# EAGLE design IMU-BLIMP (EAGLE 6.6.0)
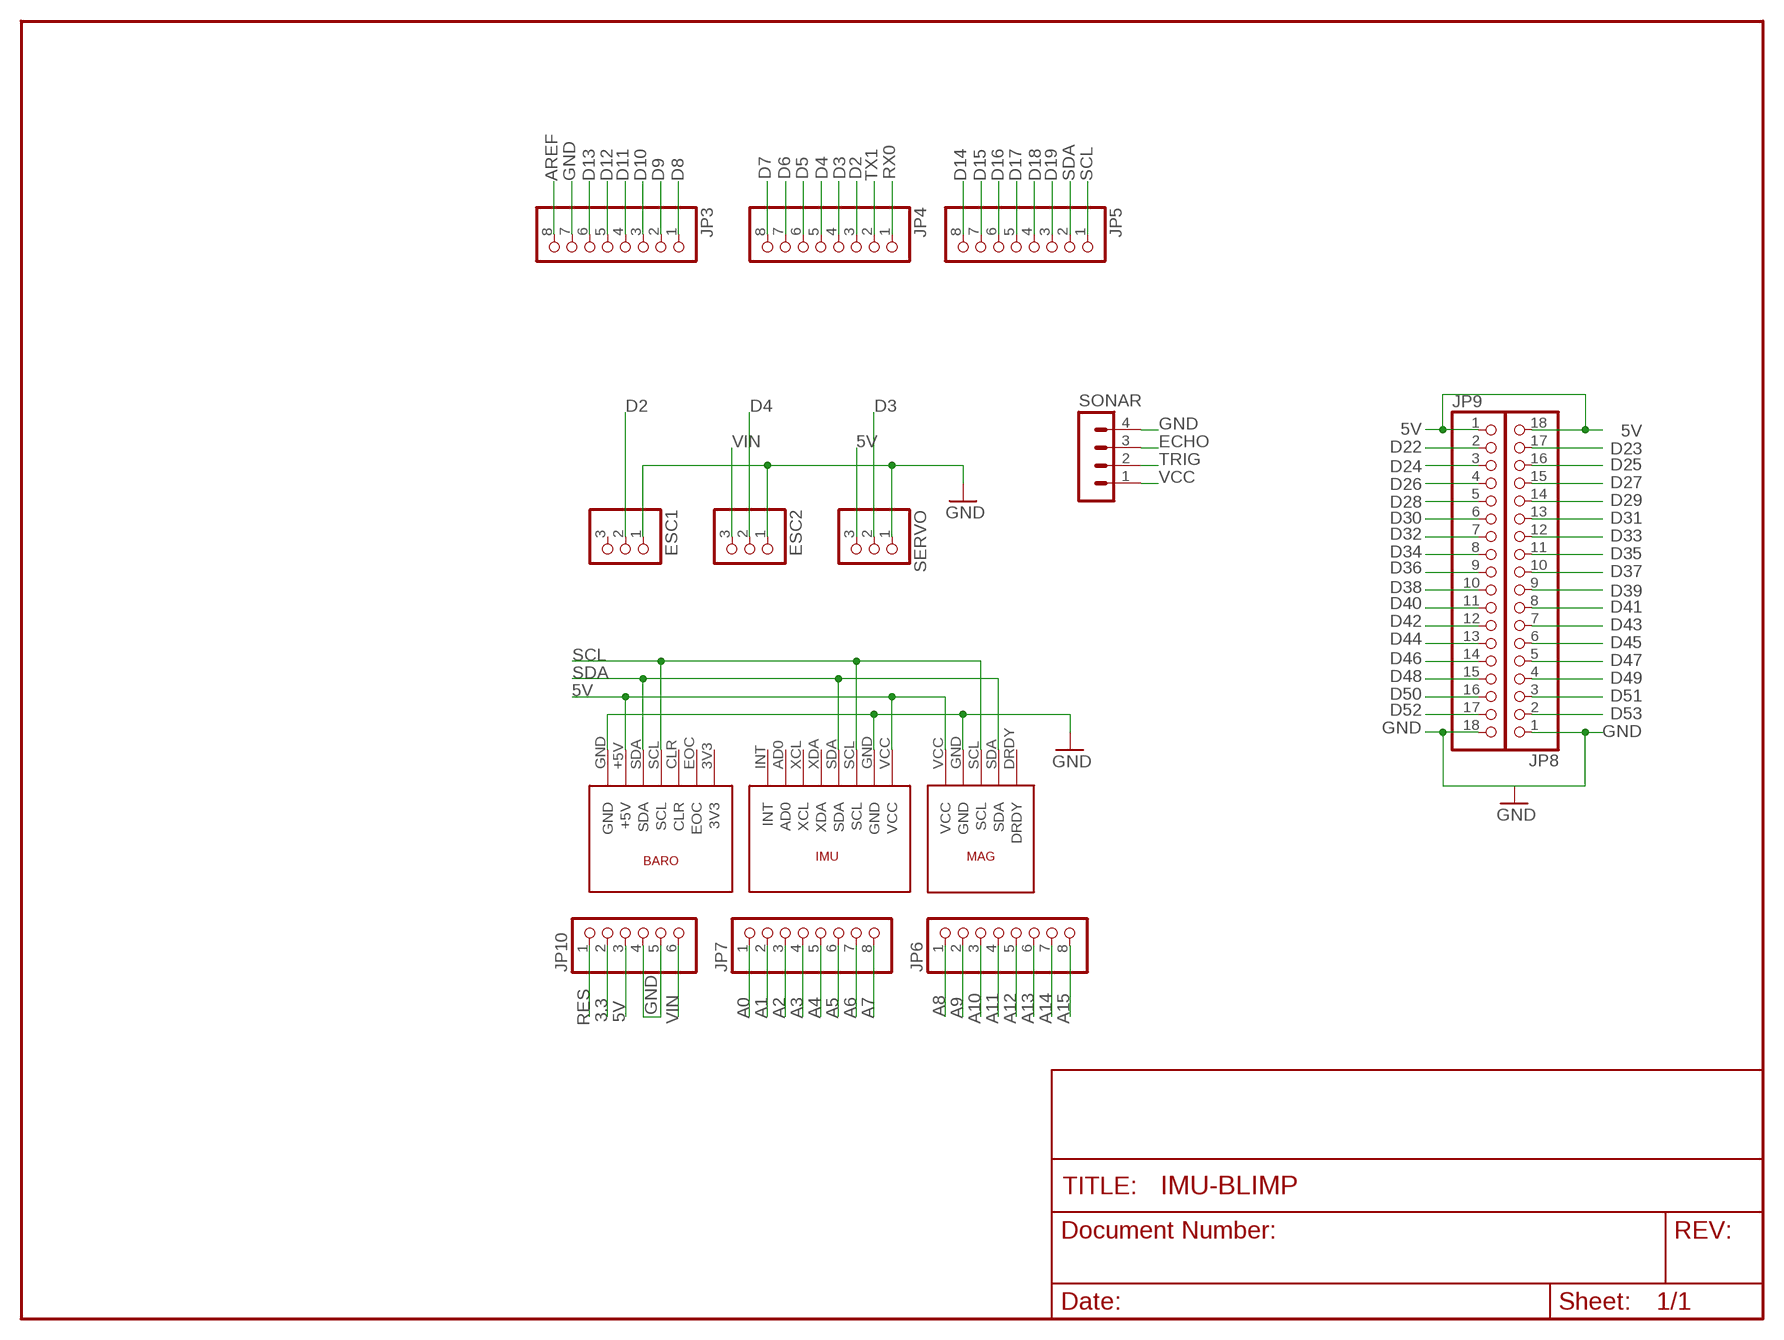
[diagram p0: schematic, sheet 1]

## Parts
BARO1  BMP085  [BMP085]
ESC1  PINHD-1X3CB  [1X03-CLEANBIG]
ESC2  PINHD-1X3CB  [1X03-CLEANBIG]
IMU1  MPU6050  [MPU6050]
JP3  PINHD-1X8CLEANBIG  [1X08-CLEANBIG]
JP4  PINHD-1X8CLEANBIG  [1X08-CLEANBIG]
JP5  PINHD-1X8CLEANBIG  [1X08-CLEANBIG]
JP6  PINHD-1X8CLEANBIG  [1X08-CLEANBIG]
JP7  PINHD-1X8CLEANBIG  [1X08-CLEANBIG]
JP8  PINHD-1X18-BIG  [1X18-BIG]
JP9  PINHD-1X18-BIG  [1X18-BIG]
JP10  PINHD-1X6CB  [1X06-CLEANBIG]
MAG1  HMC5883L  [HMC5883L]
SERVO  PINHD-1X3CB  [1X03-CLEANBIG]
SONAR  MA04-1  [MA04-1]

## Nets
3.3: JP10.2
5V: BARO1.+5V IMU1.VCC JP8.18 JP9.1 JP10.3 MAG1.VCC SERVO.3 SONAR.1
A0: JP7.1
A1: JP7.2
A2: JP7.3
A3: JP7.4
A4: JP7.5
A5: JP7.6
A6: JP7.7
A7: JP7.8
A8: JP6.1
A9: JP6.2
A10: JP6.3
A11: JP6.4
A12: JP6.5
A13: JP6.6
A14: JP6.7
A15: JP6.8
AREF: JP3.8
D2: ESC1.2 JP4.3
D3: JP4.4 SERVO.2
D4: ESC2.2 JP4.5
D5: JP4.6 SONAR.3
D6: JP4.7 SONAR.2
D7: JP4.8
D8: JP3.1
D9: JP3.2
D10: JP3.3
D11: JP3.4
D12: JP3.5
D13: JP3.6
D14: JP5.8
D15: JP5.7
D16: JP5.6
D17: JP5.5
D18: JP5.4
D19: JP5.3
D22: JP9.2
D23: JP8.17
D24: JP9.3
D25: JP8.16
D26: JP9.4
D27: JP8.15
D28: JP9.5
D29: JP8.14
D30: JP9.6
D31: JP8.13
D32: JP9.7
D33: JP8.12
D34: JP9.8
D35: JP8.11
D36: JP9.9
D37: JP8.10
D38: JP9.10
D39: JP8.9
D40: JP9.11
D41: JP8.8
D42: JP9.12
D43: JP8.7
D44: JP9.13
D45: JP8.6
D46: JP9.14
D47: JP8.5
D48: JP9.15
D49: JP8.4
D50: JP9.16
D51: JP8.3
D52: JP9.17
D53: JP8.2
GND: BARO1.GND ESC1.1 ESC2.1 IMU1.GND JP3.7 JP8.1 JP9.18 JP10.4 JP10.5 MAG1.GND SERVO.1 SONAR.4
RES: JP10.1
RX0: JP4.1
SCL: BARO1.SCL IMU1.SCL JP5.1 MAG1.SCL
SDA: BARO1.SDA IMU1.SDA JP5.2 MAG1.SDA
TX1: JP4.2
VIN: ESC2.3 JP10.6
Unconnected: BARO1.3V3 BARO1.CLR BARO1.EOC ESC1.3 IMU1.AD0 IMU1.INT IMU1.XCL IMU1.XDA MAG1.DRDY

## Notes on the sheet
- GND
- D2 | D4 | D3
- 5V | 5V
- GND
- VIN | 5V | ECHO
- TRIG
- VCC
- SCL
- SDA
- 5V
- GND | GND
- GND
- 5V

## Library data of the parts
BARO1 = BLIMP:BMP085: Barometer sensor
ESC1 ESC2 SERVO = adafruit:PINHD-1X3: PIN HEADER
IMU1 = BLIMP:MPU6050: Inertial Measurement Unit
JP3-JP7 = adafruit:PINHD-1X8: PIN HEADER
JP8 JP9 = adafruit:PINHD-1X18: PIN HEADER
JP10 = adafruit:PINHD-1X6: PIN HEADER
MAG1 = BLIMP:HMC5883L: Magnetometer sensor
SONAR = con-lstb:MA04-1: PIN HEADER; OC_FARNELL: unknown; OC_NEWARK: unknown

## Board
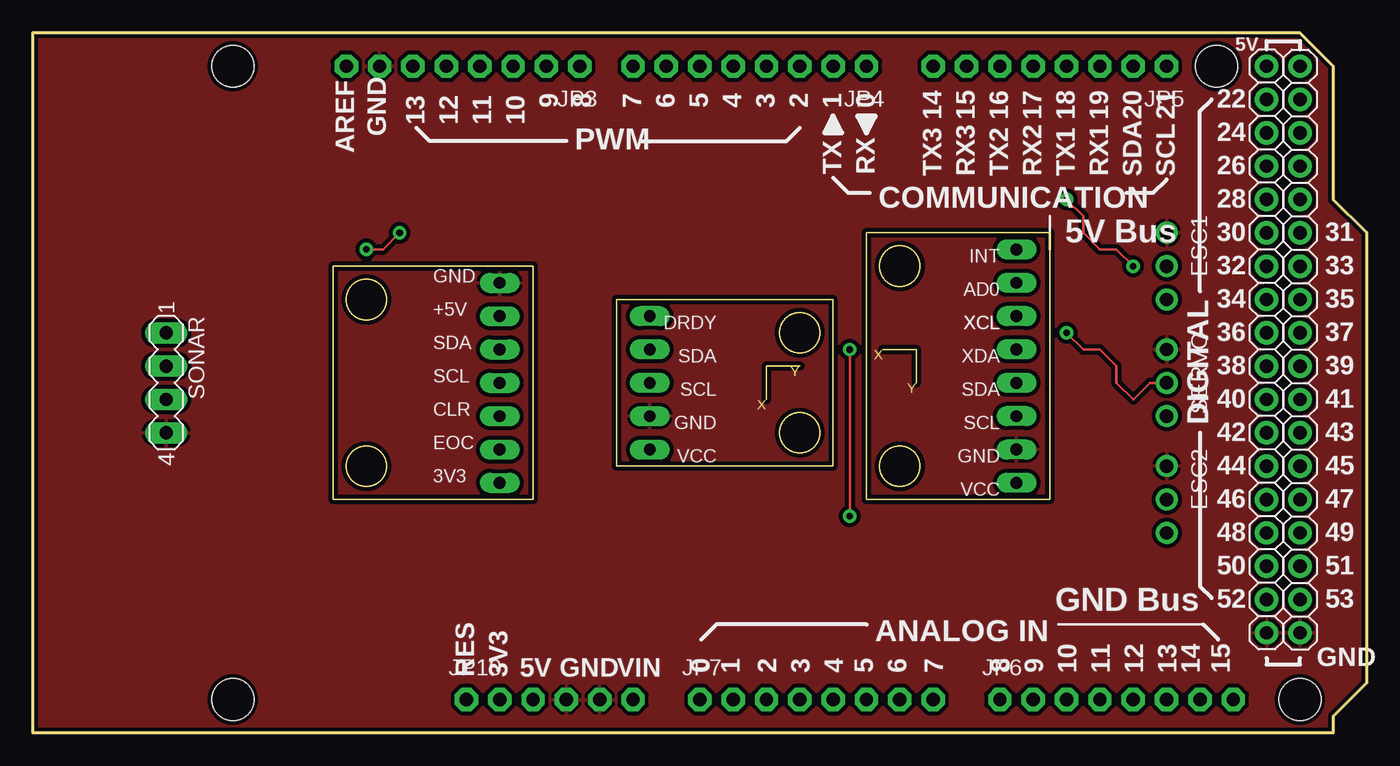
[diagram p1: board, top side]
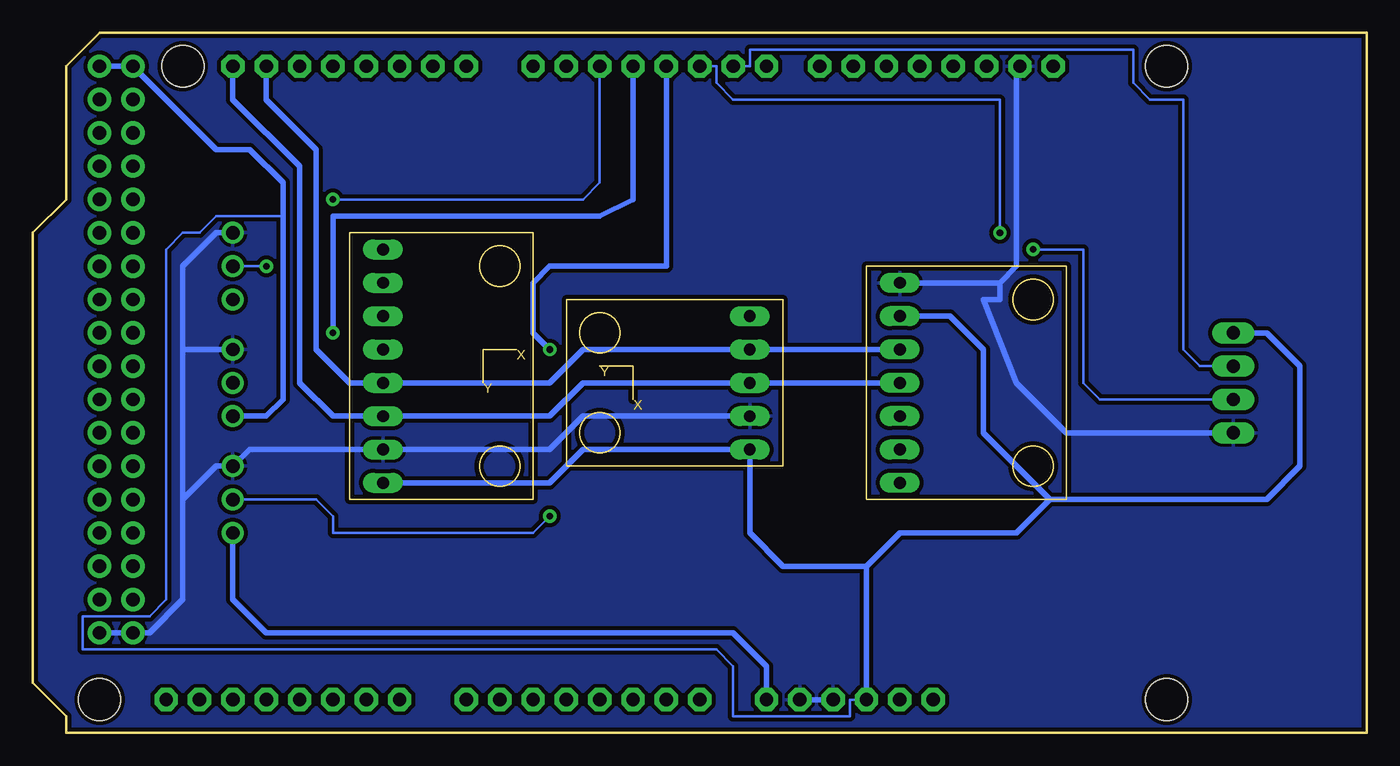
[diagram p2: board, bottom side, seen from below]

Size 101.6 x 53.34 mm. Coordinates in mm from the lower left corner, seen from the top.
Outline: 0,0 99.06,0 99.06,1.27 101.6,3.81 101.6,38.1 99.06,40.64 99.06,50.8 96.52,53.34 0,53.34 0,0
Copper layers (1*16): Top 0.035mm / dielectric 1.5mm / Bottom 0.035mm
Design rules "SparkFun": minimum track width 8mil, minimum drill 20mil, track to track 8mil, track to pad 8mil, pad to pad 8mil, via to via 8mil, smd to smd 8mil, copper to edge 10mil, drill to drill 8mil, minimum pad ring 12mil, minimum via ring 10mil, stop-mask expansion 4mil, vias tented up to drill 25mil, thermal gap 10mil
Holes 3.2 mm at 15.24,50.8 15.24,2.54 90.17,50.8 96.52,2.54

### Footprints (pad centres in the part's own frame; a part is rotated, then mirrored left to right if it is on the bottom)
BMP085 = drill 0.9 pad 1.27 long: 3V3 5.08,-7.62; +5V 5.08,5.08; CLR 5.08,-2.54; EOC 5.08,-5.08; GND 5.08,7.62; SCL 5.08,0; SDA 5.08,2.54
1X03-CLEANBIG = drill 1.016 pad 1.676: 1 -2.54,0; 2 0,0; 3 2.54,0
MPU6050 = drill 0.9 pad 1.27 long: AD0 -3.81,-6.35; GND -3.81,6.35; INT -3.81,-8.89; SCL -3.81,3.81; SDA -3.81,1.27; VCC -3.81,8.89; XCL -3.81,-3.81; XDA -3.81,-1.27
1X08-CLEANBIG = drill 1.016 pad 1.778 octagon: 1 -8.89,0; 2 -6.35,0; 3 -3.81,0; 4 -1.27,0; 5 1.27,0; 6 3.81,0; 7 6.35,0; 8 8.89,0
1X18-BIG = drill 1.016 pad 1.778: 1 -21.59,0; 2 -19.05,0; 3 -16.51,0; 4 -13.97,0; 5 -11.43,0; 6 -8.89,0; 7 -6.35,0; 8 -3.81,0; 9 -1.27,0; 10 1.27,0; 11 3.81,0; 12 6.35,0; 13 8.89,0; 14 11.43,0; 15 13.97,0; 16 16.51,0; 17 19.05,0; 18 21.59,0
1X06-CLEANBIG = drill 1.016 pad 1.778 octagon: 1 -6.35,0; 2 -3.81,0; 3 -1.27,0; 4 1.27,0; 5 3.81,0; 6 6.35,0
HMC5883L = drill 0.9 pad 1.27 long: DRDY 6.35,-5.08; GND 6.35,2.54; SCL 6.35,0; SDA 6.35,-2.54; VCC 6.35,5.08
MA04-1 = drill 1.016 long: 1 -3.81,0; 2 -1.27,0; 3 1.27,0; 4 3.81,0

### Placement (x,y rotation side)
BARO1  30.48,26.67 0 top
ESC1  86.36,35.56 270 top
ESC2  86.36,17.78 270 top
IMU1  71.12,27.94 180 top
JP3  32.77,50.8 180 top
JP4  54.61,50.8 180 top
JP5  77.47,50.8 180 top
JP6  82.55,2.54 0 top
JP7  59.69,2.54 0 top
JP8  96.52,29.21 90 top
JP9  93.98,29.21 270 top
JP10  39.37,2.54 0 top
MAG1  53.34,26.67 180 top
SERVO  86.36,26.67 270 top
SONAR  10.16,26.67 270 top

### Tracks (layer width: path | path; a pad name or v marks a point on that pad's centre or on a via)
5V
  Bottom 0.203: 82.55,39.37 87.63,39.37 88.9,38.1 90.17,38.1 91.44,36.83 91.44,10.16 92.71,8.89 97.79,8.89 97.79,6.35 49.53,6.35 48.26,5.08 48.26,1.27 39.37,1.27 39.37,2.54 JP10.3
  Bottom 0.406: IMU1.VCC 62.23,19.05 59.69,21.59 MAG1.VCC 46.99,15.24 44.45,12.7 38.1,12.7 | JP8.18 JP9.1 87.63,44.45 85.09,44.45 82.55,41.91 82.55,39.37 82.55,25.4 83.82,24.13 SERVO.3 | SONAR.1 7.62,30.48 5.08,27.94 5.08,20.32 7.62,17.78 24.13,17.78 | 24.13,17.78 29.21,22.86 29.21,29.21 31.75,31.75 BARO1.+5V | JP10.3 38.1,12.7 | 38.1,12.7 35.56,15.24 26.67,15.24 24.13,17.78
D2  (via drill 0.51)
  Top 0.203: v83.82,35.56 82.55,36.83 81.28,36.83 80.01,38.1 80.01,39.37 v78.74,40.64
  Bottom 0.203: v83.82,35.56 ESC1.2 | v78.74,40.64 59.69,40.64 58.42,41.91 JP4.3
D3  (via drill 0.51)
  Top 0.203: SERVO.2 85.09,26.67 83.82,25.4 82.55,26.67 82.55,27.94 81.28,29.21 80.01,29.21 v78.74,30.48
  Bottom 0.406: v78.74,30.48 78.74,39.37 58.42,39.37 55.88,40.64 JP4.4
D4  (via drill 0.51)
  Top 0.203: v62.23,29.21 v62.23,16.51
  Bottom 0.203: ESC2.2 80.01,17.78 78.74,16.51 78.74,15.24 63.5,15.24 v62.23,16.51
  Bottom 0.406: v62.23,29.21 63.5,30.48 63.5,34.29 62.23,35.56 53.34,35.56 JP4.5
D5  (via drill 0.51)
  Top 0.203: v25.4,36.83 26.67,36.83 v27.94,38.1
  Bottom 0.203: SONAR.3 20.32,25.4 21.59,26.67 21.59,36.83 v25.4,36.83 | v27.94,38.1 27.94,48.26 48.26,48.26 49.53,49.53 49.53,50.8 JP4.6
D6
  Bottom 0.203: SONAR.2 12.7,27.94 13.97,29.21 13.97,48.26 16.51,48.26 17.78,49.53 17.78,52.07 46.99,52.07 46.99,50.8 JP4.7
GND
  Bottom 0.406: MAG1.GND 59.69,24.13 62.23,21.59 IMU1.GND 85.09,21.59 ESC2.1 87.63,20.32 90.17,17.78 | 90.17,17.78 90.17,10.16 92.71,7.62 JP8.1 | JP10.4 JP10.5 | ESC1.1 87.63,38.1 90.17,35.56 90.17,29.21 | 90.17,29.21 90.17,17.78 | SERVO.1 90.17,29.21 | SONAR.4 22.86,22.86 26.67,26.67 29.21,33.02 27.94,33.02 27.94,34.29 | 27.94,34.29 26.67,35.56 26.67,50.55 JP3.7 | BARO1.GND 27.94,34.29
  pour Bottom (isolate 0.305): 0,0 99.06,0 99.06,1.27 101.6,3.81 101.6,38.1 99.06,40.64 99.06,50.8 96.52,53.34 0,53.34 0,2.54
  pour Top (isolate 0.305): 0,0 99.06,0 99.06,1.27 101.6,3.81 101.6,38.1 99.06,40.64 99.06,50.8 96.52,53.34 0,53.34 0,2.54
SCL
  Bottom 0.406: BARO1.SCL MAG1.SCL 59.69,26.67 62.23,24.13 IMU1.SCL 78.74,24.13 81.28,26.67 81.28,43.18 86.36,48.26 JP5.1
SDA
  Bottom 0.406: BARO1.SDA MAG1.SDA 59.69,29.21 62.23,26.67 IMU1.SDA 77.47,26.67 80.01,29.21 80.01,44.45 83.82,48.26 JP5.2
VIN
  Bottom 0.406: ESC2.3 86.36,10.16 83.82,7.62 48.26,7.62 45.72,5.08 JP10.6

### Text on the board
tPlace: 5V | 9 | 8 | 7 | 6 | 5 | 4 | 3 | 2 | 1 | 0 | 22 | 14 | 15 | 16 | 17 | 18 | 19 | 20 | 21 | 13 | 12 | 11 | 10 | GND | 24 | AREF | PWM | TX | RX | 26 | TX3 | RX3 | TX2 | RX2 | TX1 | RX1 | SDA | SCL | COMMUNICATION | 28 | 5V Bus | 30 | 31 | 32 | 33 | 34 | 35 | 36 | 37 | 38 | 39 | 40 | 41 | DIGITAL | 42 | 43 | 44 | 45 | 46 | 47 | 48 | 49 | 50 | 51 | 52 | 53 | GND Bus | ANALOG IN | 0 | 1 | 2 | 3 | 4 | 5 | 6 | 7 | 8 | 9 | 10 | 11 | 12 | 13 | 14 | 15 | GND | RES | 3V3 | 5V | GND | VIN